# Altium schematic sheet Filter Capacitors - Serial Communication.SchDoc: Serial Communication Filter Capacitors
size A4; DocumentNumber: 41; SheetNumber: 40; SheetTotal: 54
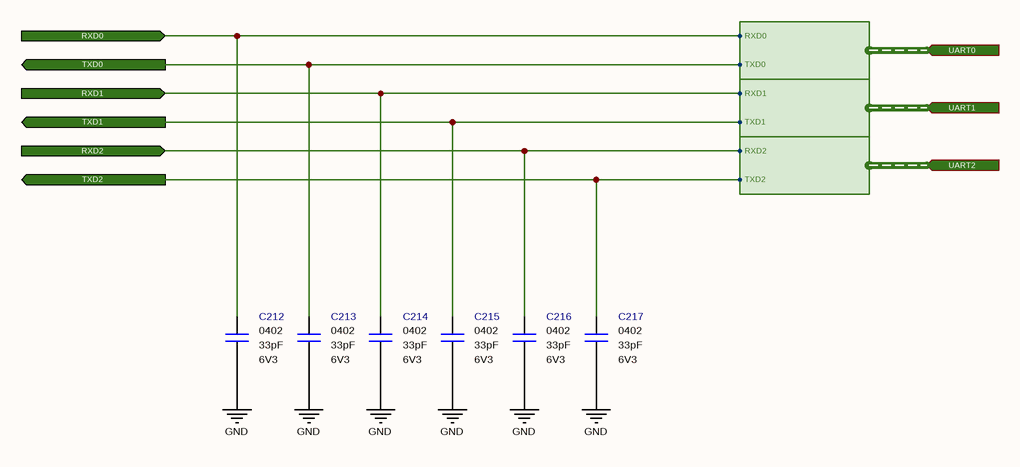
[diagram p0: Filter Capacitors - Serial Communication.SchDoc]

## Parts
C212  value 33pF  Case: 0402  Voltage: 6V3  [CAPACITOR_0402]  (hidden comment: Multilayer Ceramic Capacitor)
C213  value 33pF  Case: 0402  Voltage: 6V3  [CAPACITOR_0402]  (hidden comment: Multilayer Ceramic Capacitor)
C214  value 33pF  Case: 0402  Voltage: 6V3  [CAPACITOR_0402]  (hidden comment: Multilayer Ceramic Capacitor)
C215  value 33pF  Case: 0402  Voltage: 6V3  [CAPACITOR_0402]  (hidden comment: Multilayer Ceramic Capacitor)
C216  value 33pF  Case: 0402  Voltage: 6V3  [CAPACITOR_0402]  (hidden comment: Multilayer Ceramic Capacitor)
C217  value 33pF  Case: 0402  Voltage: 6V3  [CAPACITOR_0402]  (hidden comment: Multilayer Ceramic Capacitor)

## Ports
RXD0 (in), RXD1 (in), RXD2 (in), TXD0 (out), TXD1 (out), TXD2 (out), UART0 (in, harness UART0), UART1 (in, harness UART1), UART2 (in, harness UART2)

## Harnesses
UART0: RXD0, TXD0
UART1: RXD1, TXD1
UART2: RXD2, TXD2

## Nets
GND: C212.1 C213.1 C214.1 C215.1 C216.1 C217.1
RXD0: C212.2 ; port RXD0, port UART0.RXD0
RXD1: C214.2 ; port RXD1, port UART1.RXD1
RXD2: C216.2 ; port RXD2, port UART2.RXD2
TXD0: C213.2 ; port TXD0, port UART0.TXD0
TXD1: C215.2 ; port TXD1, port UART1.TXD1
TXD2: C217.2 ; port TXD2, port UART2.TXD2

## Notes on the sheet
- Engineer
- All Rights are reserved to Customer and Engineer. [2021]
- Size:
- Date:
- A4
- Project :
- Time:
- Sheet
- of
- Customer
- Product ID
- Module ID
- Version
- File:
- Revision

## Library data of the parts
C212-C217 = Capacitor - 33pF [0402-6V3]: Capacitor - 33pF [0402] (Ceramic); Manufacturer Name: Kemet; Manufacturer Part Number: C0402C330J9RACAUTO; Dielectric: X7R; Tolerance: 10%; Height: 0.5mm; Maximum Operating Temperature: +125; Minimum Operating Temperature: -55; ROHS: Yes; ComponentLink1Description: DataSheet; ComponentLink1URL: https://api.kemet.com/component-edge/download/datasheet/C0402C330J9RACAUTO.pdf; ComponentLink2Description: Mouser; ComponentLink2URL: https://www.mouser.com/Search/Refine.aspx?Keyword=80-C0402C330J9RAUTO; Supplier 1: Mouser; Supplier Part Number 1: 80-C0402C330J9RAUTO; Mouser Part Number: 80-C0402C330J9RAUTO